# Altium schematic sheet current_measure.SchDoc
size A; SheetNumber: 3; SheetTotal: 5
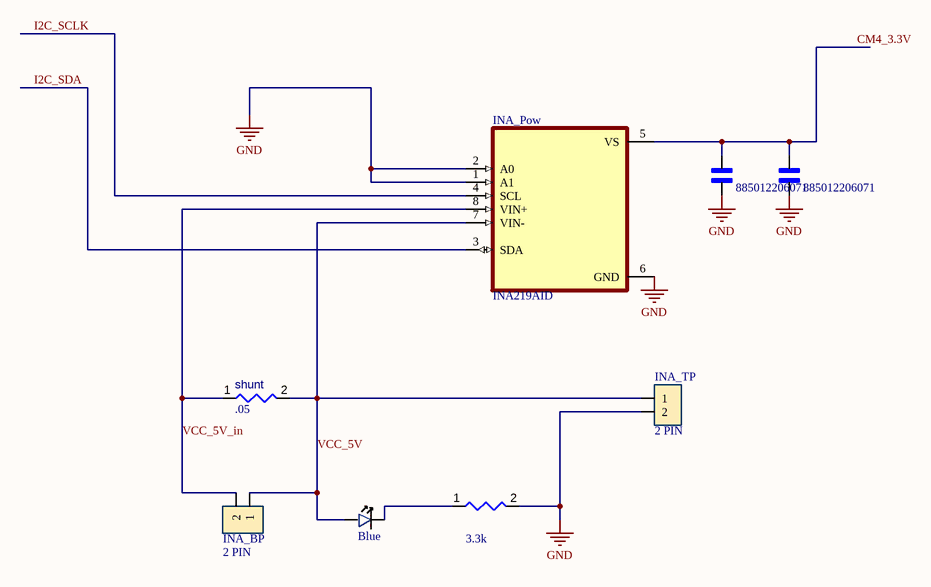
[diagram p0: current_measure.SchDoc]

## Parts
(Parts that share a designator on the sheet are numbered #1, #2 ... from top to bottom, then left to right.)
?#1  885012206071  [WCAP-CSGP_885012206071]
?#2  885012206071  [WCAP-CSGP_885012206071]
?#3  value 3.3k  [RESC2013X50X35ML15T15]  (hidden comment: Resistor 10k +/-1% 0805 125 mW)
?#4  value Blue  [LED_0603]  (hidden comment: 0603Bl)
INA_BP  2 PIN  [2_PIN_100MIL]
INA_Pow  INA219AID  [SOIC127P599X175-8N]
INA_TP  2 PIN  [2_PIN_100MIL]
shunt  value .05  [RESC2013X50X35ML15T15]  (hidden comment: Resistor 10k +/-1% 0805 125 mW)

## Nets
GND: ?#1.2 ?#2.2 ?#3.2 INA_Pow.1(A1) INA_Pow.2(A0) INA_Pow.6(GND) INA_TP.2
CM4_3.3V: ?#1.1 ?#2.1 INA_Pow.5(VS)
I2C_SCLK: INA_Pow.4(SCL)
I2C_SDA: INA_Pow.3(SDA)
VCC_5V: ?#4.1 INA_BP.1 INA_Pow.7(VIN-) INA_TP.1 shunt.2
VCC_5V_in: INA_BP.2 INA_Pow.8(VIN+) shunt.1
Net?#3_1: ?#3.1 ?#4.2

## Library data of the parts
?#1 ?#2 = 885012206071: WCAP-CSGP General Purpose MLCC; SMT 0603; X7R; 100nF 10%; 25V; -55C to +125C; Tech. PN X7R0603104K025DFCT10000; MF: Wurth Electronics Inc; Package: 0603 Wurth Electronics; Purchase-URL: https://pricing.snapeda.com/search/part/885012206071/?ref=eda; Price: None; Value: *; Availability: Warning; MP: 885012206071; SnapEDA_Link: https://www.snapeda.com/parts/885012206071/Wurth%20Electronics%20Inc/view-part/4217095/?ref=snap
?#3 shunt = CMP-009-00018-5: Chip Resistor, 10 KOhm, +/- 1%, 125 mW, -55 to 155 degC, 0805 (2012 Metric); Power: 125mW; Voltage Rating: 150V; Tolerance: 1%; Pins: 2; Min Operating Temperature: -55°C; Case/Package: 0805; Max Operating Temperature: 155°C; RoHS Compliant: True; Mounting Technology: SM
?#4 = LED_BLUE_0603: LIGHT EMITTING DIODES (LED) BLUE 465~475NM 11.5~28.5MCD@5MA TOP VIEW 0603 ROHS; MFR Part #: 19-217/BHC-ZL1M2RY/3T; LCSC Part#: C72041; Type: Basic
INA_BP INA_TP = JM_2_PIN_MALE: 2.54mm Straight 2 1 Header，Breakaway Through Hole,P=2.54mm Pin Header & Female Header ROHS; MFR Part #: B-2100S02P-A110; Type: Extended; Datasheet: https://datasheet.lcsc.com/lcsc/1811151421_Ckmtw-Shenzhen-Cankemeng-B-2100S02P-A110_C124375.pdf; LCSC Part#: C124375; Value: 2 PIN
INA_Pow = INA219AID: 26V, 12-bit, i2c output current/voltage/power monitor 8-SOIC -40 to 125; MF: Texas Instruments; Purchase-URL: https://pricing.snapeda.com/search/part/INA219AID/?ref=eda; Package: SOIC-8 Texas Instruments; SnapEDA_Link: https://www.snapeda.com/parts/INA219AID/Texas%20Instruments/view-part/522322/?ref=snap; Value: *; Price: None; MP: INA219AID; Availability: Warning; Check_prices: https://www.snapeda.com/parts/INA219AID/Texas%20Instruments/view-part/522322/?ref=eda